# EAGLE design mains_expander (EAGLE 8.6.0)
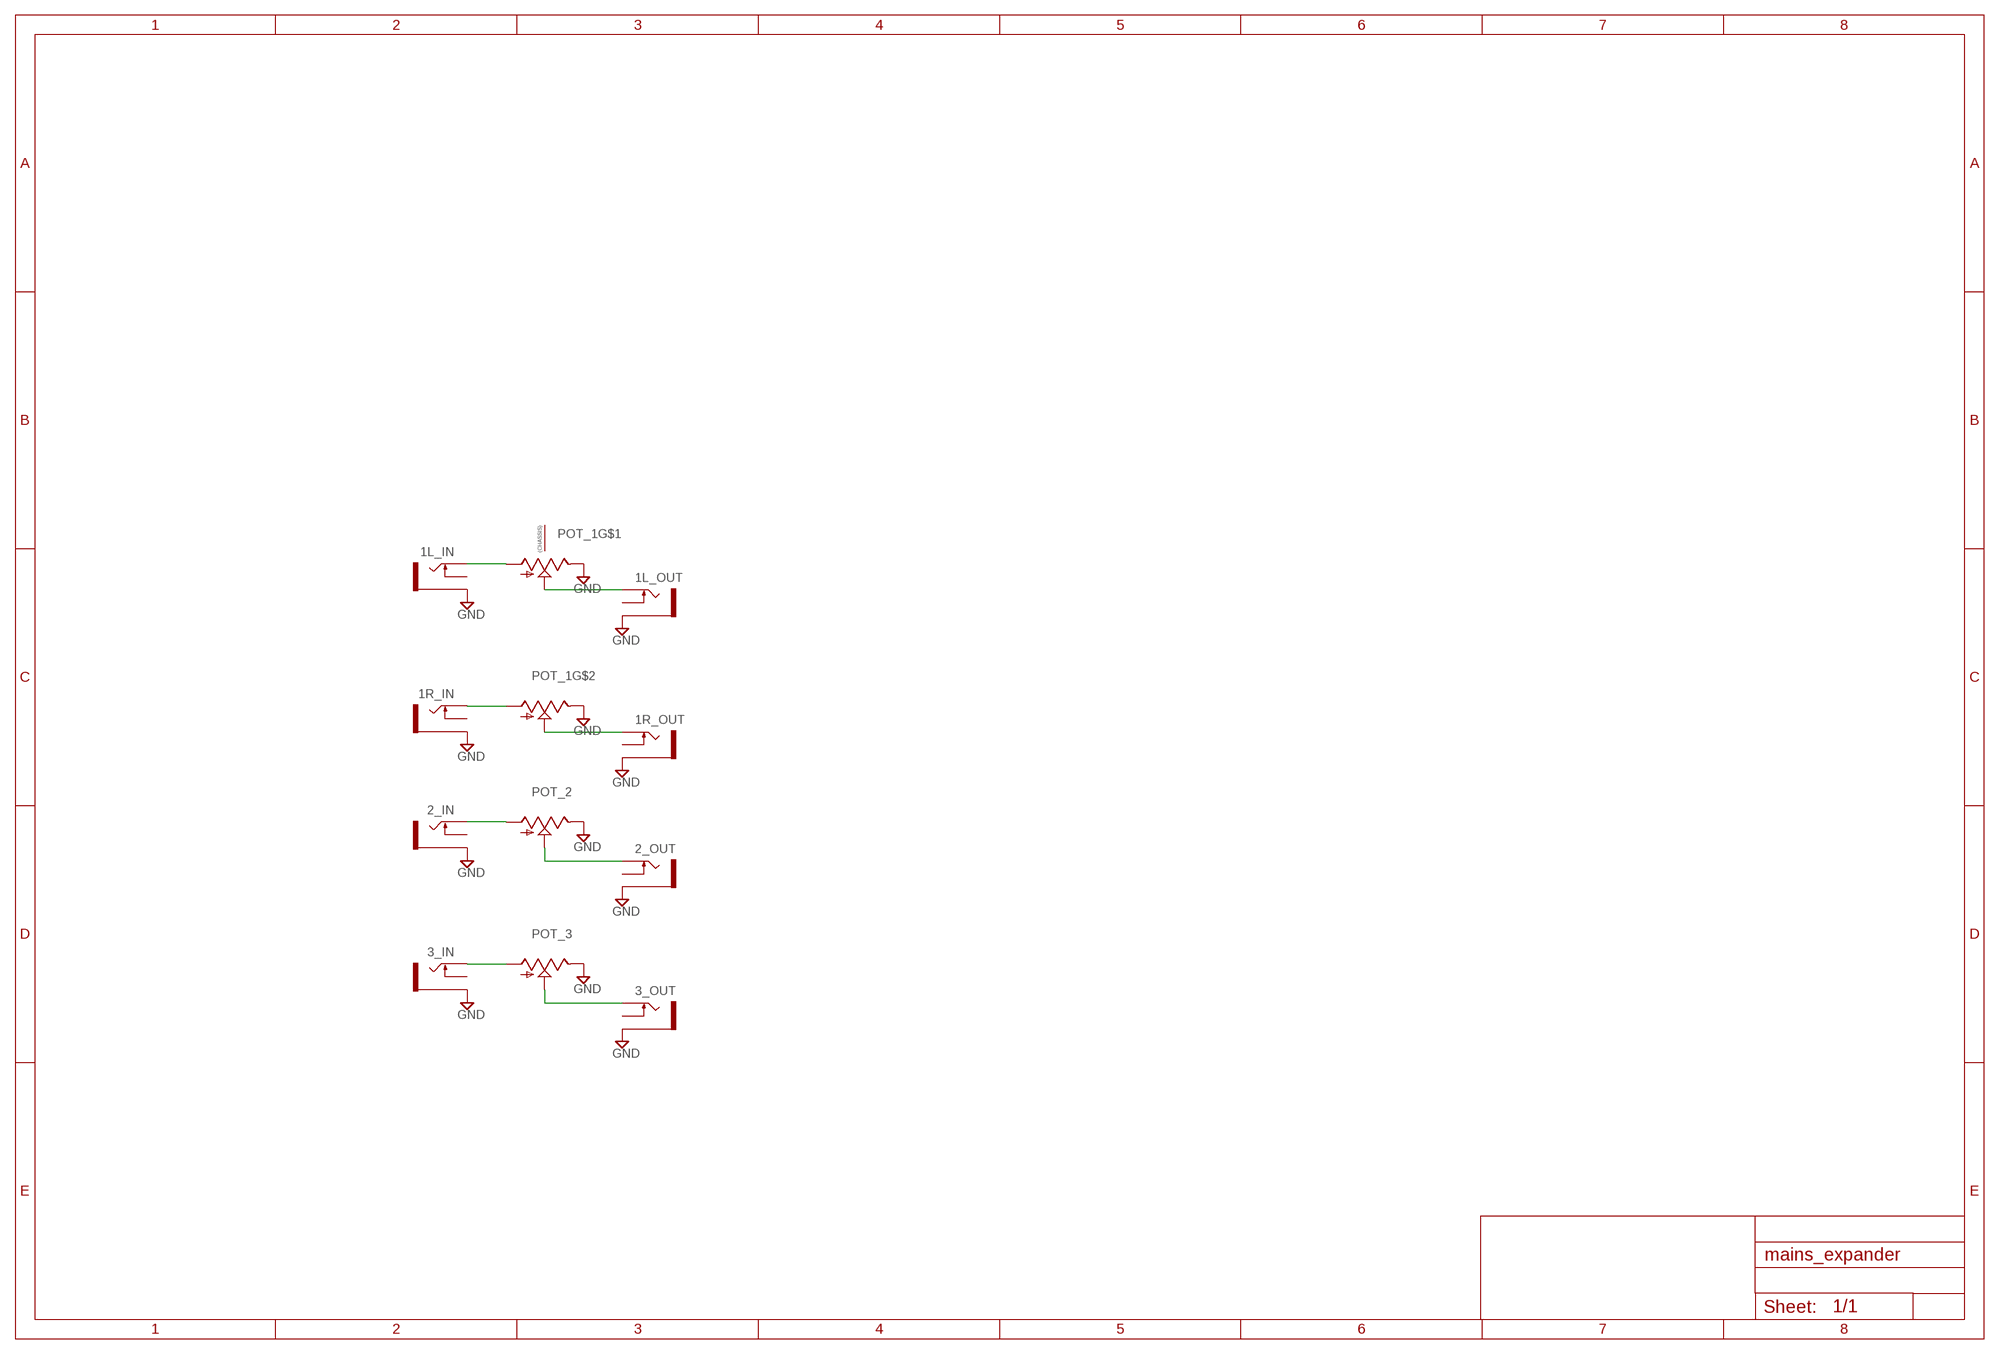
[diagram p0: schematic, sheet 1]

## Parts
1L_IN  THONKICONNNEW  [WQP-PJ301M-12_JACK]
1L_OUT  THONKICONNNEW  [WQP-PJ301M-12_JACK]
1R_IN  THONKICONNNEW  [WQP-PJ301M-12_JACK]
1R_OUT  THONKICONNNEW  [WQP-PJ301M-12_JACK]
2_IN  THONKICONNNEW  [WQP-PJ301M-12_JACK]
2_OUT  THONKICONNNEW  [WQP-PJ301M-12_JACK]
3_IN  THONKICONNNEW  [WQP-PJ301M-12_JACK]
3_OUT  THONKICONNNEW  [WQP-PJ301M-12_JACK]
POT_1  ALPHA-9MM-DUALPOT  [DUAL_9MM_SNAP-IN_POT]
POT_2  9MM_SNAP-IN_POT_  [9MM_SNAP-IN_POT]
POT_3  9MM_SNAP-IN_POT_  [9MM_SNAP-IN_POT]

## Nets
GND: 1L_IN.P$3_SLEEVE(SLEEVE) 1L_OUT.P$3_SLEEVE(SLEEVE) 1R_IN.P$3_SLEEVE(SLEEVE) 1R_OUT.P$3_SLEEVE(SLEEVE) 2_IN.P$3_SLEEVE(SLEEVE) 2_OUT.P$3_SLEEVE(SLEEVE) 3_IN.P$3_SLEEVE(SLEEVE) 3_OUT.P$3_SLEEVE(SLEEVE) POT_1.3(E) POT_1.3B(E) POT_2.3(E) POT_3.3(E)
N$1: 2_IN.P$1_TIP(TIP) POT_2.1(A)
N$2: 3_IN.P$1_TIP(TIP) POT_3.1(A)
N$3: 1R_IN.P$1_TIP(TIP) POT_1.1B(A)
N$4: 1L_IN.P$1_TIP(TIP) POT_1.1(A)
N$5: 1L_OUT.P$1_TIP(TIP) POT_1.2(S)
N$6: 2_OUT.P$1_TIP(TIP) POT_2.2(S)
N$7: 1R_OUT.P$1_TIP(TIP) POT_1.2B(S)
N$8: 3_OUT.P$1_TIP(TIP) POT_3.2(S)
Unconnected: 1L_IN.P$2_SWITCH(SWITCH) 1L_OUT.P$2_SWITCH(SWITCH) 1R_IN.P$2_SWITCH(SWITCH) 1R_OUT.P$2_SWITCH(SWITCH) 2_IN.P$2_SWITCH(SWITCH) 2_OUT.P$2_SWITCH(SWITCH) 3_IN.P$2_SWITCH(SWITCH) 3_OUT.P$2_SWITCH(SWITCH) POT_1.CHASSIS1 POT_1.CHASSIS2

## Library data of the parts
1L_IN 1L_OUT 1R_IN 1R_OUT 2_IN 2_OUT 3_IN 3_OUT = MusicThingModular:THONKICONN: 3.5mm socket for Eurorack modular synths
POT_1 = MusicThingModular:ALPHA-9MM-DUALPOT: 9mm vertical snap-in pot, Alpha / Panasonic style, with a connection to the metal chassis for grounding
POT_2 POT_3 = MusicThingModular:9MM_SNAP-IN_POT: 9mm vertical snap-in pot, Alpha / Panasonic style

## Board
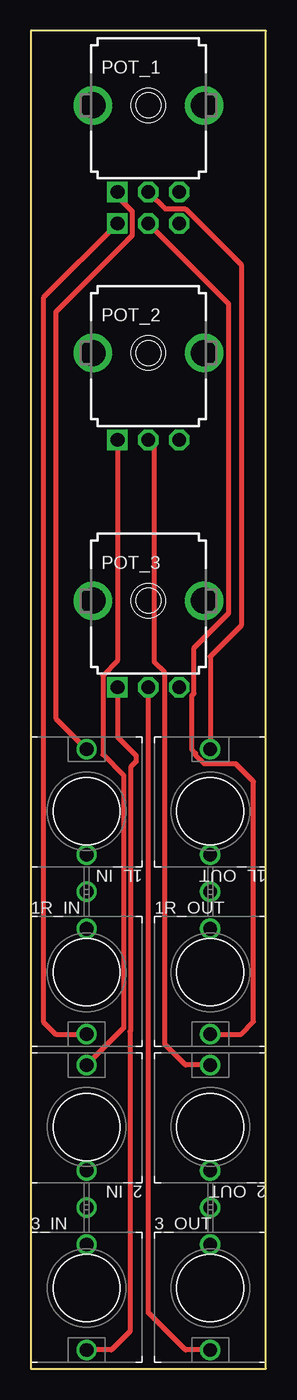
[diagram p1: board, top side]
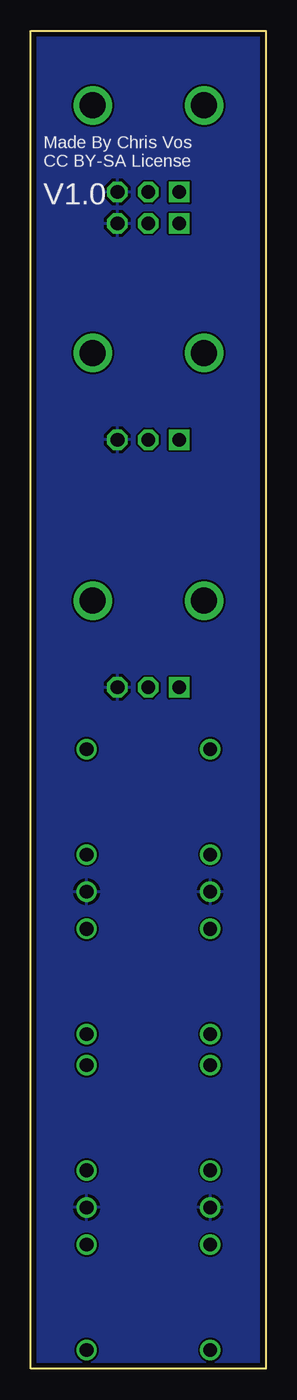
[diagram p2: board, bottom side, seen from below]

Size 19 x 108 mm. Coordinates in mm from the lower left corner, seen from the top.
Outline: 0,0 19,0 19,108 0,108 0,0
Copper layers (1*16): Top 0.035559375mm / dielectric 1.6mm / Bottom 0.035559375mm
Design rules "oshpark-2layer": minimum track width 6mil, minimum drill 10mil, track to track 6mil, track to pad 6mil, pad to pad 6mil, via to via 6mil, smd to smd 6mil, copper to edge 15mil, drill to drill 6mil, minimum pad ring 5mil, minimum via ring 5mil, stop-mask expansion 2.5mil, vias tented up to drill 0mil, thermal gap 10mil

### Footprints (pad centres in the part's own frame; a part is rotated, then mirrored left to right if it is on the bottom)
WQP-PJ301M-12_JACK = drill 1.1: P$1_TIP 0,5; P$2_SWITCH 0,-3.5; P$3_SLEEVE 0,-6.5
DUAL_9MM_SNAP-IN_POT = drill 1.1 square: 1 -2.5,-7; 1B -2.5,-9.54 | drill 1.1 octagon: 2 0,-7; 2B 0,-9.54; 3 2.5,-7; 3B 2.5,-9.54 | drill 2.1 pad 2.54: CHASSIS1 -4.5,0; CHASSIS2 4.5,0
9MM_SNAP-IN_POT = drill 1.1 square: 1 -2.5,-7 | drill 1.1 octagon: 2 0,-7; 3 2.5,-7 | drill 2.1 pad 2.794: CHASSIS1 -4.5,0; CHASSIS2 4.5,0

### Placement (x,y rotation side)
1L_IN  4.5,45 0 top
1L_OUT  14.5,45 0 top
1R_IN  4.5,32 180 top
1R_OUT  14.5,32 180 top
2_IN  4.5,19.5 0 top
2_OUT  14.5,19.5 0 top
3_IN  4.5,6.5 180 top
3_OUT  14.5,6.5 180 top
POT_1  9.5,102 0 top
POT_2  9.5,82 0 top
POT_3  9.5,62 0 top

### Tracks (layer width: path | path; a pad name or v marks a point on that pad's centre or on a via)
GND
  pour Bottom: 0,0 19,0 19,108 0,108
N$1
  Top 0.406: POT_2.1 7,57.15 5.82,55.97 5.82,49.57 7.5,47.88 7.5,27.5 2_IN.P$1_TIP
N$2
  Top 0.406: POT_3.1 7,51 8.5,49.5 8.5,49 8.06,48.56 8.06,27.27 8,27.21 8,3 6.5,1.5 3_IN.P$1_TIP
N$3
  Top 0.406: POT_1.1B 1,86.46 1,28 2,27 1R_IN.P$1_TIP
N$4
  Top 0.406: POT_1.1 7,94.61 8.18,93.43 8.18,91.49 2,85.31 2,52.5 1L_IN.P$1_TIP
N$5
  Top 0.406: 1L_OUT.P$1_TIP 14.5,57.5 17,60 17,89.13 12.49,93.64 10.86,93.64 POT_1.2
N$6
  Top 0.406: POT_2.2 10,74.5 10,57 10.82,56.18 10.82,26.18 12.5,24.5 2_OUT.P$1_TIP
N$7
  Top 0.406: 1R_OUT.P$1_TIP 17,27 18,28 18,47.39 16.57,48.82 14.01,48.82 13.32,49.51 13.32,49.68 13,50 13,54.33 13.18,54.51 13.18,58.18 16,61 16,85.96 POT_1.2B
N$8
  Top 0.406: 3_OUT.P$1_TIP 12.5,1.5 9.5,4.5 POT_3.2

### Text on the board
bNames: Made By Chris Vos / CC BY-SA License | V1.0